# EAGLE schematic VibrationDrive1 (EAGLE 7.2.0)
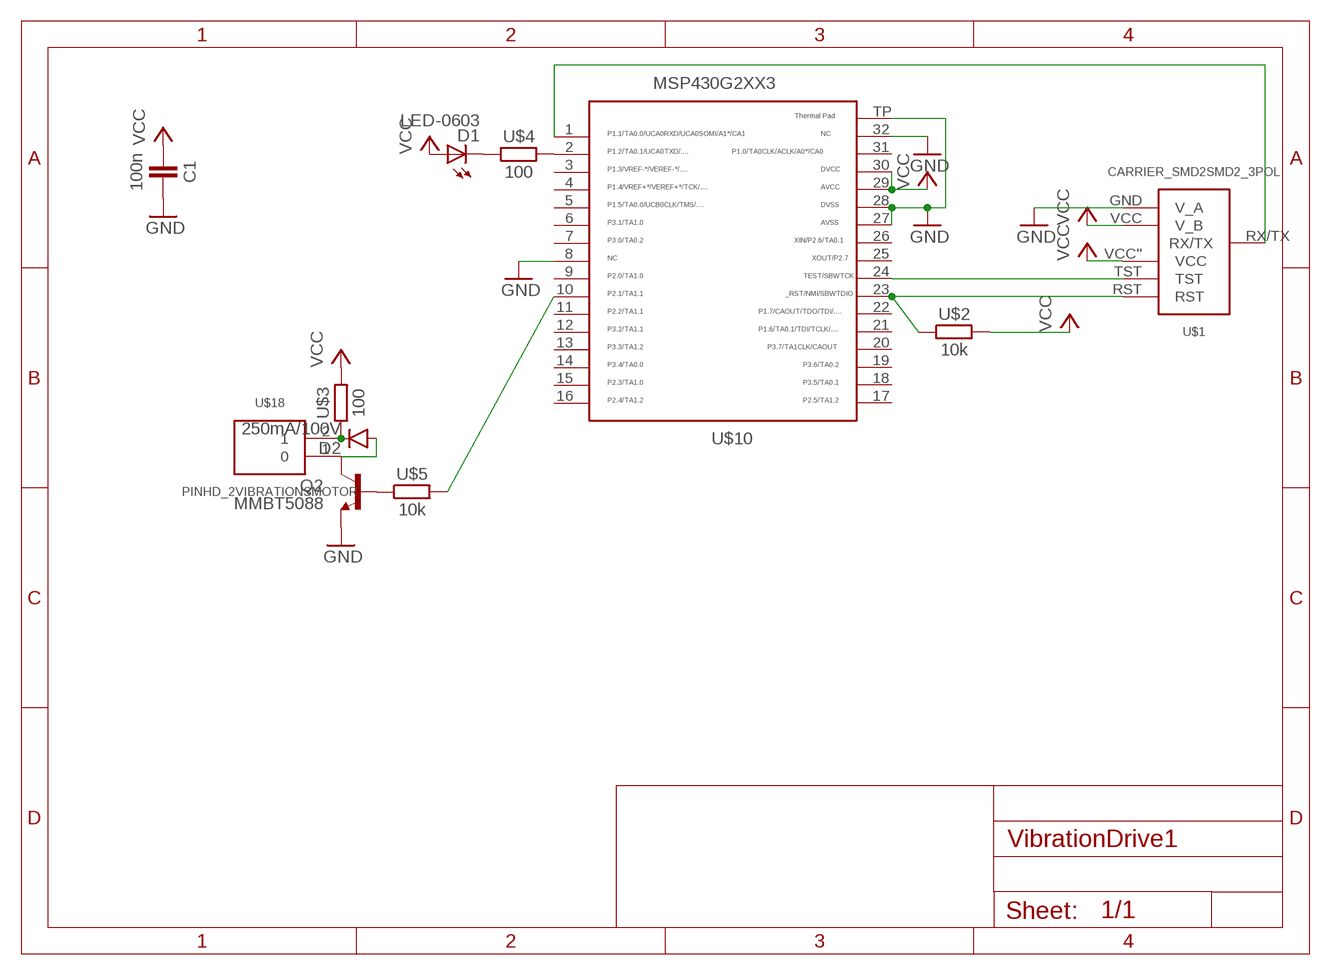
[diagram p0: schematic, sheet 1]

## Parts
C1  100n  CAPACITOR  [603]
D1  LED-0603  [LED_0603]
D2  250mA/100V  DIODEBAS16  [SOD-323]
Q2  MMBT5088  TRANSISTOR_NPNMMBT5088  [SOT23-3]
U$1  CARRIER_SMD2SMD2_3POL  [CARRIER_SMD2_3POL]
U$2  10k  RESISTOR0603  [603]
U$3  100  RESISTOR0603  [603]
U$4  100  RESISTOR0603  [603]
U$5  10k  RESISTOR0603  [603]
U$10  MSP430G2553  [QFN32]
U$18  PINHD_2VIBRATIONSMOTOR  [VIBRATIONSMOTOR]

## Nets
GND: C1.2 Q2.2(E) U$1.GND(V_A) U$10.8 U$10.27 U$10.28 U$10.32 U$10.TP
N$3: U$1.TST U$10.24
N$4: U$1.RST U$2.1 U$10.23
N$5: U$5.2 U$10.10
N$6: Q2.1(B) U$5.1
N$7: D2.A Q2.3(C) U$18.1
N$11: D2.C U$3.1 U$18.2
N$12: U$1.RX/TX U$10.1
N$13: U$4.2 U$10.2
N$14: D1.C U$4.1
VCC: C1.1 D1.A U$1.VCC''(VCC) U$1.VCC(V_B) U$2.2 U$3.2 U$10.29 U$10.30
Unconnected: U$10.3 U$10.4 U$10.5 U$10.6 U$10.7 U$10.9 U$10.11 U$10.12 U$10.13 U$10.14 U$10.15 U$10.16 U$10.17 U$10.18 U$10.19 U$10.20 U$10.21 U$10.22 U$10.25 U$10.26 U$10.31

## Library data of the parts
C1 = thar:CAPACITOR
D1 = we-opto:LED: LEDs
D2 = SparkFun-DiscreteSemi:DIODE: Diode These are standard reverse protection diodes and small signal diodes. SMA package can handle up to about 1A. SOD-323 can handle about 200mA. What the SOD-323 package when ordering, there are some mfgs out there that are 5-pin packages.; PROD_ID: DIO-09646
Q2 = SparkFun-DiscreteSemi:TRANSISTOR_NPN: Generic NPN BJT MMBT2222A - TRANS-08049 (SOT-23, 1A 40V) MPSA42 - TRANS-09116 (SOT-23, 500mA 300V) MMBT5088LT1G - TRANS-11160 (SOT-23, 50 mA 30V) BC547 - COM-08928 <http://www.sparkfun.com/products/8928> (TO-92 45V 100mA) (1.Collector 2.Base 3.Emitter) 2N3904 - COM-00521 <http://www.sparkfun.com/products/521> (TO-92 40V 200mA) (1.Emitter 2.Base 3.Collector) P2N2222A - COM-12852 <http://www.sparkfun.com/products/12852> (TO-92 40V 600mA) (1.Collector 2.Base 3.Emitter); PROD_ID: TRANS-11160
U$1 = thar:CARRIER_SMD2
U$2-U$5 = thar:RESISTOR
U$10 = thar:MSP430G2553: TEXAS INSTRUMENTS MSP430G2553IRHB32R MCU, 16BIT, MSP430, 16MHZ, QFN-32 Farnell Best.Nr.: 2325726 Herst.Bez.: MSP430G2553IRHB32R
U$18 = thar:PINHD_2